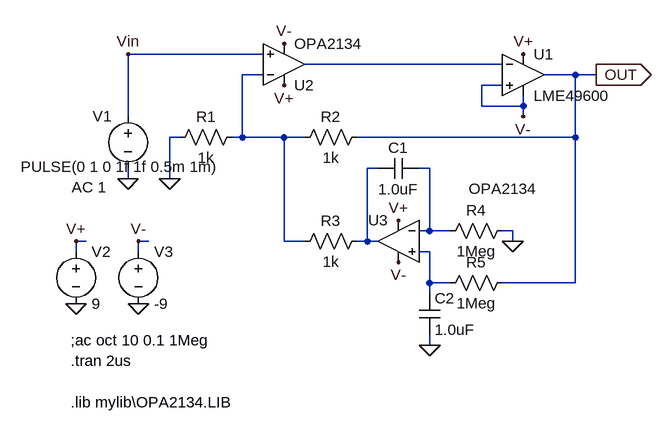
[diagram p0: schematic OPAMP_Servo_Step_Responce.asc]
OPAMP_Servo_Step_Responce.asc, the LTspice schematic file:
Version 4
SHEET 1 1064 680
WIRE -112 128 -320 128
WIRE 256 144 -48 144
WIRE -112 160 -144 160
WIRE 368 160 320 160
WIRE 400 160 368 160
WIRE 256 176 224 176
WIRE 224 208 224 176
WIRE 288 208 288 192
WIRE 288 208 224 208
WIRE -320 224 -320 128
WIRE 288 224 288 208
WIRE -240 256 -256 256
WIRE -144 256 -144 160
WIRE -144 256 -160 256
WIRE -80 256 -144 256
WIRE -48 256 -80 256
WIRE 368 256 368 160
WIRE 368 256 32 256
WIRE 64 304 48 304
WIRE 144 304 128 304
WIRE -320 320 -320 304
WIRE -256 320 -256 256
WIRE 144 400 144 304
WIRE 144 400 128 400
WIRE 176 400 144 400
WIRE 272 400 256 400
WIRE -384 416 -400 416
WIRE -288 416 -304 416
WIRE -80 416 -80 256
WIRE -48 416 -80 416
WIRE 48 416 48 304
WIRE 48 416 32 416
WIRE 64 416 48 416
WIRE 272 416 272 400
WIRE -400 432 -400 416
WIRE -304 432 -304 416
WIRE 144 432 128 432
WIRE 144 480 144 432
WIRE 176 480 144 480
WIRE 368 480 368 256
WIRE 368 480 256 480
WIRE 144 496 144 480
WIRE 144 576 144 560
FLAG -320 320 0
FLAG -400 512 0
FLAG -304 512 0
FLAG -400 416 V+
FLAG -304 416 V-
FLAG 288 128 V+
FLAG 288 224 V-
FLAG 400 160 OUT
IOPIN 400 160 Out
FLAG -256 320 0
FLAG 144 576 0
FLAG 272 416 0
FLAG -80 176 V+
FLAG 96 384 V+
FLAG -80 112 V-
FLAG 96 448 V-
FLAG -320 128 Vin
SYMBOL Opamps\\LME49600 288 96 R0
SYMATTR InstName U1
SYMBOL voltage -320 208 R0
WINDOW 123 -87 125 Left 2
WINDOW 39 0 0 Left 2
WINDOW 0 -54 16 Left 2
WINDOW 3 -165 93 Left 2
SYMATTR Value2 AC 1
SYMATTR InstName V1
SYMATTR Value PULSE(0 1 0 1f 1f 0.5m 1m)
SYMBOL voltage -400 416 R0
WINDOW 123 0 0 Left 2
WINDOW 39 0 0 Left 2
SYMATTR InstName V2
SYMATTR Value 9
SYMBOL voltage -304 416 R0
WINDOW 123 0 0 Left 2
WINDOW 39 0 0 Left 2
SYMATTR InstName V3
SYMATTR Value -9
SYMBOL res -144 240 R90
WINDOW 0 0 56 VBottom 2
WINDOW 3 32 56 VTop 2
SYMATTR InstName R1
SYMATTR Value 1k
SYMBOL res 48 240 R90
WINDOW 0 0 56 VBottom 2
WINDOW 3 32 56 VTop 2
SYMATTR InstName R2
SYMATTR Value 1k
SYMBOL res 48 400 R90
WINDOW 0 0 56 VBottom 2
WINDOW 3 32 56 VTop 2
SYMATTR InstName R3
SYMATTR Value 1k
SYMBOL res 272 384 R90
WINDOW 0 0 56 VBottom 2
WINDOW 3 32 56 VTop 2
SYMATTR InstName R4
SYMATTR Value 1Meg
SYMBOL res 272 464 R90
WINDOW 0 0 56 VBottom 2
WINDOW 3 32 56 VTop 2
SYMATTR InstName R5
SYMATTR Value 1Meg
SYMBOL cap 128 288 R90
WINDOW 0 0 32 VBottom 2
WINDOW 3 32 32 VTop 2
SYMATTR InstName C1
SYMATTR Value 1.0uF
SYMBOL cap 128 496 R0
SYMATTR InstName C2
SYMATTR Value 1.0uF
SYMBOL Opamps\\opamp2 -80 208 M180
SYMATTR InstName U2
SYMATTR Value OPA2134
SYMBOL Opamps\\opamp2 96 352 M0
WINDOW 3 -212 -17 Left 2
SYMATTR InstName U3
SYMATTR Value OPA2134
TEXT -408 568 Left 2 !;ac oct 10 0.1 1Meg
TEXT -408 600 Left 2 !.tran 2us
TEXT -408 664 Left 2 !.lib mylib\\OPA2134.LIB

The netlist it stands for:
* OPAMP_Servo_Step_Responce.asc
XU1 V- N001 V+ V- OUT LME49600  ; pins In+ In- V+ V- OUT
V1 Vin 0 PULSE(0 1 0 1f 1f 0.5m 1m) AC 1
V2 V+ 0 9
V3 V- 0 -9
R1 N002 0 1k
R2 OUT N002 1k
R3 N003 N002 1k
R4 0 N004 1Meg
R5 OUT N005 1Meg
C1 N004 N003 1.0uF
C2 N005 0 1.0uF
XU2 Vin N002 V+ V- N001 OPA2134  ; pins In+ In- V+ V- OUT
XU3 N005 N004 V+ V- N003 OPA2134  ; pins In+ In- V+ V- OUT
;ac oct 10 0.1 1Meg
.tran 2us
.lib mylib\OPA2134.LIB
.backanno
.end